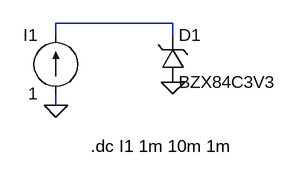
[diagram p0: schematic Draft2.asc]
Draft2.asc, the LTspice schematic file:
Version 4
SHEET 1 880 680
WIRE 288 112 128 112
WIRE 128 128 128 112
WIRE 288 128 288 112
WIRE 128 224 128 208
FLAG 128 224 0
FLAG 288 192 0
SYMBOL current 128 208 R180
WINDOW 0 24 80 Left 2
WINDOW 3 24 0 Left 2
WINDOW 123 0 0 Left 0
WINDOW 39 0 0 Left 0
SYMATTR InstName I1
SYMATTR Value 1
SYMBOL zener 272 192 M180
WINDOW 0 24 64 Left 2
WINDOW 3 24 0 Left 2
SYMATTR InstName D1
SYMATTR Value BZX84C3V3
TEXT 176 280 Left 2 !.dc I1 1m 10m 1m

The netlist it stands for:
* Draft2.asc
I1 0 N001 1
D1 0 N001 BZX84C3V3
.model D D
.lib standard.dio
.dc I1 1m 10m 1m
.backanno
.end